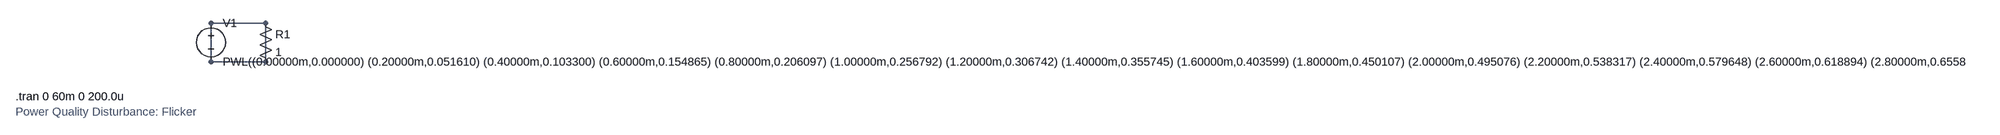
[diagram p0: schematic Flicker.asc]
Flicker.asc, the LTspice schematic file:
Version 4
SHEET 1 880 680
WIRE 192 128 80 128
WIRE 80 128 80 208
WIRE 192 208 80 208
WIRE 192 128 192 208
SYMBOL voltage 80 112 R0
WINDOW 123 0 0 Left 0
WINDOW 39 0 0 Left 0
SYMATTR InstName V1
SYMATTR Value PWL((0.00000m,0.000000) (0.20000m,0.051610) (0.40000m,0.103300) (0.60000m,0.154865) (0.80000m,0.206097) (1.00000m,0.256792) (1.20000m,0.306742) (1.40000m,0.355745) (1.60000m,0.403599) (1.80000m,0.450107) (2.00000m,0.495076) (2.20000m,0.538317) (2.40000m,0.579648) (2.60000m,0.618894) (2.80000m,0.655887) (3.00000m,0.690465) (3.20000m,0.722479) (3.40000m,0.751786) (3.60000m,0.778255) (3.80000m,0.801764) (4.00000m,0.822205) (4.20000m,0.839480) (4.40000m,0.853502) (4.60000m,0.864200) (4.80000m,0.871514) (5.00000m,0.875397) (5.20000m,0.875816) (5.40000m,0.872752) (5.60000m,0.866201) (5.80000m,0.856172) (6.00000m,0.842689) (6.20000m,0.825787) (6.40000m,0.805520) (6.60000m,0.781952) (6.80000m,0.755163) (7.00000m,0.725245) (7.20000m,0.692303) (7.40000m,0.656457) (7.60000m,0.617836) (7.80000m,0.576584) (8.00000m,0.532854) (8.20000m,0.486812) (8.40000m,0.438632) (8.60000m,0.388498) (8.80000m,0.336604) (9.00000m,0.283151) (9.20000m,0.228348) (9.40000m,0.172408) (9.60000m,0.115553) (9.80000m,0.058007) (10.00000m,0.000000) (10.20000m,-0.058238) (10.40000m,-0.116472) (10.60000m,-0.174469) (10.80000m,-0.231993) (11.00000m,-0.288813) (11.20000m,-0.344695) (11.40000m,-0.399412) (11.60000m,-0.452739) (11.80000m,-0.504456) (12.00000m,-0.554349) (12.20000m,-0.602211) (12.40000m,-0.647841) (12.60000m,-0.691049) (12.80000m,-0.731652) (13.00000m,-0.769477) (13.20000m,-0.804363) (13.40000m,-0.836160) (13.60000m,-0.864729) (13.80000m,-0.889947) (14.00000m,-0.911699) (14.20000m,-0.929889) (14.40000m,-0.944432) (14.60000m,-0.955258) (14.80000m,-0.962314) (15.00000m,-0.965560) (15.20000m,-0.964973) (15.40000m,-0.960544) (15.60000m,-0.952280) (15.80000m,-0.940205) (16.00000m,-0.924358) (16.20000m,-0.904794) (16.40000m,-0.881580) (16.60000m,-0.854804) (16.80000m,-0.824563) (17.00000m,-0.790972) (17.20000m,-0.754158) (17.40000m,-0.714264) (17.60000m,-0.671443) (17.80000m,-0.625861) (18.00000m,-0.577697) (18.20000m,-0.527141) (18.40000m,-0.474390) (18.60000m,-0.419655) (18.80000m,-0.363151) (19.00000m,-0.305104) (19.20000m,-0.245745) (19.40000m,-0.185311) (19.60000m,-0.124045) (19.80000m,-0.062192) (20.00000m,-0.000000) (20.20000m,0.062279) (20.40000m,0.124396) (20.60000m,0.186098) (20.80000m,0.247137) (21.00000m,0.307266) (21.20000m,0.366241) (21.40000m,0.423823) (21.60000m,0.479779) (21.80000m,0.533880) (22.00000m,0.585908) (22.20000m,0.635650) (22.40000m,0.682904) (22.60000m,0.727477) (22.80000m,0.769188) (23.00000m,0.807867) (23.20000m,0.843355) (23.40000m,0.875509) (23.60000m,0.904196) (23.80000m,0.929300) (24.00000m,0.950718) (24.20000m,0.968363) (24.40000m,0.982161) (24.60000m,0.992058) (24.80000m,0.998013) (25.00000m,1.000000) (25.20000m,0.998013) (25.40000m,0.992058) (25.60000m,0.982161) (25.80000m,0.968363) (26.00000m,0.950718) (26.20000m,0.929300) (26.40000m,0.904196) (26.60000m,0.875509) (26.80000m,0.843355) (27.00000m,0.807867) (27.20000m,0.769188) (27.40000m,0.727477) (27.60000m,0.682904) (27.80000m,0.635650) (28.00000m,0.585908) (28.20000m,0.533880) (28.40000m,0.479779) (28.60000m,0.423823) (28.80000m,0.366241) (29.00000m,0.307266) (29.20000m,0.247137) (29.40000m,0.186098) (29.60000m,0.124396) (29.80000m,0.062279) (30.00000m,0.000000) (30.20000m,-0.062192) (30.40000m,-0.124045) (30.60000m,-0.185311) (30.80000m,-0.245745) (31.00000m,-0.305104) (31.20000m,-0.363151) (31.40000m,-0.419655) (31.60000m,-0.474390) (31.80000m,-0.527141) (32.00000m,-0.577697) (32.20000m,-0.625861) (32.40000m,-0.671443) (32.60000m,-0.714264) (32.80000m,-0.754158) (33.00000m,-0.790972) (33.20000m,-0.824563) (33.40000m,-0.854804) (33.60000m,-0.881580) (33.80000m,-0.904794) (34.00000m,-0.924358) (34.20000m,-0.940205) (34.40000m,-0.952280) (34.60000m,-0.960544) (34.80000m,-0.964973) (35.00000m,-0.965560) (35.20000m,-0.962314) (35.40000m,-0.955258) (35.60000m,-0.944432) (35.80000m,-0.929889) (36.00000m,-0.911699) (36.20000m,-0.889947) (36.40000m,-0.864729) (36.60000m,-0.836160) (36.80000m,-0.804363) (37.00000m,-0.769477) (37.20000m,-0.731652) (37.40000m,-0.691049) (37.60000m,-0.647841) (37.80000m,-0.602211) (38.00000m,-0.554349) (38.20000m,-0.504456) (38.40000m,-0.452739) (38.60000m,-0.399412) (38.80000m,-0.344695) (39.00000m,-0.288813) (39.20000m,-0.231993) (39.40000m,-0.174469) (39.60000m,-0.116472) (39.80000m,-0.058238) (40.00000m,-0.000000) (40.20000m,0.058007) (40.40000m,0.115553) (40.60000m,0.172408) (40.80000m,0.228348) (41.00000m,0.283151) (41.20000m,0.336604) (41.40000m,0.388498) (41.60000m,0.438632) (41.80000m,0.486812) (42.00000m,0.532854) (42.20000m,0.576584) (42.40000m,0.617836) (42.60000m,0.656457) (42.80000m,0.692303) (43.00000m,0.725245) (43.20000m,0.755163) (43.40000m,0.781952) (43.60000m,0.805520) (43.80000m,0.825787) (44.00000m,0.842689) (44.20000m,0.856172) (44.40000m,0.866201) (44.60000m,0.872752) (44.80000m,0.875816) (45.00000m,0.875397) (45.20000m,0.871514) (45.40000m,0.864200) (45.60000m,0.853502) (45.80000m,0.839480) (46.00000m,0.822205) (46.20000m,0.801764) (46.40000m,0.778255) (46.60000m,0.751786) (46.80000m,0.722479) (47.00000m,0.690465) (47.20000m,0.655887) (47.40000m,0.618894) (47.60000m,0.579648) (47.80000m,0.538317) (48.00000m,0.495076) (48.20000m,0.450107) (48.40000m,0.403599) (48.60000m,0.355745) (48.80000m,0.306742) (49.00000m,0.256792) (49.20000m,0.206097) (49.40000m,0.154865) (49.60000m,0.103300) (49.80000m,0.051610) (50.00000m,0.000000) (50.20000m,-0.051325) (50.40000m,-0.102164) (50.60000m,-0.152318) (50.80000m,-0.201591) (51.00000m,-0.249794) (51.20000m,-0.296741) (51.40000m,-0.342254) (51.60000m,-0.386161) (51.80000m,-0.428298) (52.00000m,-0.468507) (52.20000m,-0.506640) (52.40000m,-0.542560) (52.60000m,-0.576136) (52.80000m,-0.607250) (53.00000m,-0.635792) (53.20000m,-0.661665) (53.40000m,-0.684782) (53.60000m,-0.705068) (53.80000m,-0.722459) (54.00000m,-0.736904) (54.20000m,-0.748361) (54.40000m,-0.756804) (54.60000m,-0.762217) (54.80000m,-0.764596) (55.00000m,-0.763948) (55.20000m,-0.760294) (55.40000m,-0.753665) (55.60000m,-0.744106) (55.80000m,-0.731669) (56.00000m,-0.716420) (56.20000m,-0.698436) (56.40000m,-0.677803) (56.60000m,-0.654616) (56.80000m,-0.628981) (57.00000m,-0.601012) (57.20000m,-0.570833) (57.40000m,-0.538574) (57.60000m,-0.504372) (57.80000m,-0.468373) (58.00000m,-0.430728) (58.20000m,-0.391593) (58.40000m,-0.351128) (58.60000m,-0.309501) (58.80000m,-0.266879) (59.00000m,-0.223434) (59.20000m,-0.179341) (59.40000m,-0.134774) (59.60000m,-0.089911) (59.80000m,-0.044928))
SYMBOL res 176 112 R0
SYMATTR InstName R1
SYMATTR Value 1
TEXT -320 280 Left 2 !.tran 0 60m 0 200.0u
TEXT -320 312 Left 2 ;Power Quality Disturbance: Flicker

The netlist it stands for:
* Flicker.asc
V1 N001 N001 PWL((0.00000m,0.000000) (0.20000m,0.051610) (0.40000m,0.103300) (0.60000m,0.154865) (0.80000m,0.206097) (1.00000m,0.256792) (1.20000m,0.306742) (1.40000m,0.355745) (1.60000m,0.403599) (1.80000m,0.450107) (2.00000m,0.495076) (2.20000m,0.538317) (2.40000m,0.579648) (2.60000m,0.618894) (2.80000m,0.655887) (3.00000m,0.690465) (3.20000m,0.722479) (3.40000m,0.751786) (3.60000m,0.778255) (3.80000m,0.801764) (4.00000m,0.822205) (4.20000m,0.839480) (4.40000m,0.853502) (4.60000m,0.864200) (4.80000m,0.871514) (5.00000m,0.875397) (5.20000m,0.875816) (5.40000m,0.872752) (5.60000m,0.866201) (5.80000m,0.856172) (6.00000m,0.842689) (6.20000m,0.825787) (6.40000m,0.805520) (6.60000m,0.781952) (6.80000m,0.755163) (7.00000m,0.725245) (7.20000m,0.692303) (7.40000m,0.656457) (7.60000m,0.617836) (7.80000m,0.576584) (8.00000m,0.532854) (8.20000m,0.486812) (8.40000m,0.438632) (8.60000m,0.388498) (8.80000m,0.336604) (9.00000m,0.283151) (9.20000m,0.228348) (9.40000m,0.172408) (9.60000m,0.115553) (9.80000m,0.058007) (10.00000m,0.000000) (10.20000m,-0.058238) (10.40000m,-0.116472) (10.60000m,-0.174469) (10.80000m,-0.231993) (11.00000m,-0.288813) (11.20000m,-0.344695) (11.40000m,-0.399412) (11.60000m,-0.452739) (11.80000m,-0.504456) (12.00000m,-0.554349) (12.20000m,-0.602211) (12.40000m,-0.647841) (12.60000m,-0.691049) (12.80000m,-0.731652) (13.00000m,-0.769477) (13.20000m,-0.804363) (13.40000m,-0.836160) (13.60000m,-0.864729) (13.80000m,-0.889947) (14.00000m,-0.911699) (14.20000m,-0.929889) (14.40000m,-0.944432) (14.60000m,-0.955258) (14.80000m,-0.962314) (15.00000m,-0.965560) (15.20000m,-0.964973) (15.40000m,-0.960544) (15.60000m,-0.952280) (15.80000m,-0.940205) (16.00000m,-0.924358) (16.20000m,-0.904794) (16.40000m,-0.881580) (16.60000m,-0.854804) (16.80000m,-0.824563) (17.00000m,-0.790972) (17.20000m,-0.754158) (17.40000m,-0.714264) (17.60000m,-0.671443) (17.80000m,-0.625861) (18.00000m,-0.577697) (18.20000m,-0.527141) (18.40000m,-0.474390) (18.60000m,-0.419655) (18.80000m,-0.363151) (19.00000m,-0.305104) (19.20000m,-0.245745) (19.40000m,-0.185311) (19.60000m,-0.124045) (19.80000m,-0.062192) (20.00000m,-0.000000) (20.20000m,0.062279) (20.40000m,0.124396) (20.60000m,0.186098) (20.80000m,0.247137) (21.00000m,0.307266) (21.20000m,0.366241) (21.40000m,0.423823) (21.60000m,0.479779) (21.80000m,0.533880) (22.00000m,0.585908) (22.20000m,0.635650) (22.40000m,0.682904) (22.60000m,0.727477) (22.80000m,0.769188) (23.00000m,0.807867) (23.20000m,0.843355) (23.40000m,0.875509) (23.60000m,0.904196) (23.80000m,0.929300) (24.00000m,0.950718) (24.20000m,0.968363) (24.40000m,0.982161) (24.60000m,0.992058) (24.80000m,0.998013) (25.00000m,1.000000) (25.20000m,0.998013) (25.40000m,0.992058) (25.60000m,0.982161) (25.80000m,0.968363) (26.00000m,0.950718) (26.20000m,0.929300) (26.40000m,0.904196) (26.60000m,0.875509) (26.80000m,0.843355) (27.00000m,0.807867) (27.20000m,0.769188) (27.40000m,0.727477) (27.60000m,0.682904) (27.80000m,0.635650) (28.00000m,0.585908) (28.20000m,0.533880) (28.40000m,0.479779) (28.60000m,0.423823) (28.80000m,0.366241) (29.00000m,0.307266) (29.20000m,0.247137) (29.40000m,0.186098) (29.60000m,0.124396) (29.80000m,0.062279) (30.00000m,0.000000) (30.20000m,-0.062192) (30.40000m,-0.124045) (30.60000m,-0.185311) (30.80000m,-0.245745) (31.00000m,-0.305104) (31.20000m,-0.363151) (31.40000m,-0.419655) (31.60000m,-0.474390) (31.80000m,-0.527141) (32.00000m,-0.577697) (32.20000m,-0.625861) (32.40000m,-0.671443) (32.60000m,-0.714264) (32.80000m,-0.754158) (33.00000m,-0.790972) (33.20000m,-0.824563) (33.40000m,-0.854804) (33.60000m,-0.881580) (33.80000m,-0.904794) (34.00000m,-0.924358) (34.20000m,-0.940205) (34.40000m,-0.952280) (34.60000m,-0.960544) (34.80000m,-0.964973) (35.00000m,-0.965560) (35.20000m,-0.962314) (35.40000m,-0.955258) (35.60000m,-0.944432) (35.80000m,-0.929889) (36.00000m,-0.911699) (36.20000m,-0.889947) (36.40000m,-0.864729) (36.60000m,-0.836160) (36.80000m,-0.804363) (37.00000m,-0.769477) (37.20000m,-0.731652) (37.40000m,-0.691049) (37.60000m,-0.647841) (37.80000m,-0.602211) (38.00000m,-0.554349) (38.20000m,-0.504456) (38.40000m,-0.452739) (38.60000m,-0.399412) (38.80000m,-0.344695) (39.00000m,-0.288813) (39.20000m,-0.231993) (39.40000m,-0.174469) (39.60000m,-0.116472) (39.80000m,-0.058238) (40.00000m,-0.000000) (40.20000m,0.058007) (40.40000m,0.115553) (40.60000m,0.172408) (40.80000m,0.228348) (41.00000m,0.283151) (41.20000m,0.336604) (41.40000m,0.388498) (41.60000m,0.438632) (41.80000m,0.486812) (42.00000m,0.532854) (42.20000m,0.576584) (42.40000m,0.617836) (42.60000m,0.656457) (42.80000m,0.692303) (43.00000m,0.725245) (43.20000m,0.755163) (43.40000m,0.781952) (43.60000m,0.805520) (43.80000m,0.825787) (44.00000m,0.842689) (44.20000m,0.856172) (44.40000m,0.866201) (44.60000m,0.872752) (44.80000m,0.875816) (45.00000m,0.875397) (45.20000m,0.871514) (45.40000m,0.864200) (45.60000m,0.853502) (45.80000m,0.839480) (46.00000m,0.822205) (46.20000m,0.801764) (46.40000m,0.778255) (46.60000m,0.751786) (46.80000m,0.722479) (47.00000m,0.690465) (47.20000m,0.655887) (47.40000m,0.618894) (47.60000m,0.579648) (47.80000m,0.538317) (48.00000m,0.495076) (48.20000m,0.450107) (48.40000m,0.403599) (48.60000m,0.355745) (48.80000m,0.306742) (49.00000m,0.256792) (49.20000m,0.206097) (49.40000m,0.154865) (49.60000m,0.103300) (49.80000m,0.051610) (50.00000m,0.000000) (50.20000m,-0.051325) (50.40000m,-0.102164) (50.60000m,-0.152318) (50.80000m,-0.201591) (51.00000m,-0.249794) (51.20000m,-0.296741) (51.40000m,-0.342254) (51.60000m,-0.386161) (51.80000m,-0.428298) (52.00000m,-0.468507) (52.20000m,-0.506640) (52.40000m,-0.542560) (52.60000m,-0.576136) (52.80000m,-0.607250) (53.00000m,-0.635792) (53.20000m,-0.661665) (53.40000m,-0.684782) (53.60000m,-0.705068) (53.80000m,-0.722459) (54.00000m,-0.736904) (54.20000m,-0.748361) (54.40000m,-0.756804) (54.60000m,-0.762217) (54.80000m,-0.764596) (55.00000m,-0.763948) (55.20000m,-0.760294) (55.40000m,-0.753665) (55.60000m,-0.744106) (55.80000m,-0.731669) (56.00000m,-0.716420) (56.20000m,-0.698436) (56.40000m,-0.677803) (56.60000m,-0.654616) (56.80000m,-0.628981) (57.00000m,-0.601012) (57.20000m,-0.570833) (57.40000m,-0.538574) (57.60000m,-0.504372) (57.80000m,-0.468373) (58.00000m,-0.430728) (58.20000m,-0.391593) (58.40000m,-0.351128) (58.60000m,-0.309501) (58.80000m,-0.266879) (59.00000m,-0.223434) (59.20000m,-0.179341) (59.40000m,-0.134774) (59.60000m,-0.089911) (59.80000m,-0.044928))
R1 N001 N001 1
.tran 0 60m 0 200.0u
* Power Quality Disturbance: Flicker
.backanno
.end